# EAGLE schematic Maya Ayoub Custom Sch v40 (EAGLE 9.7.0)
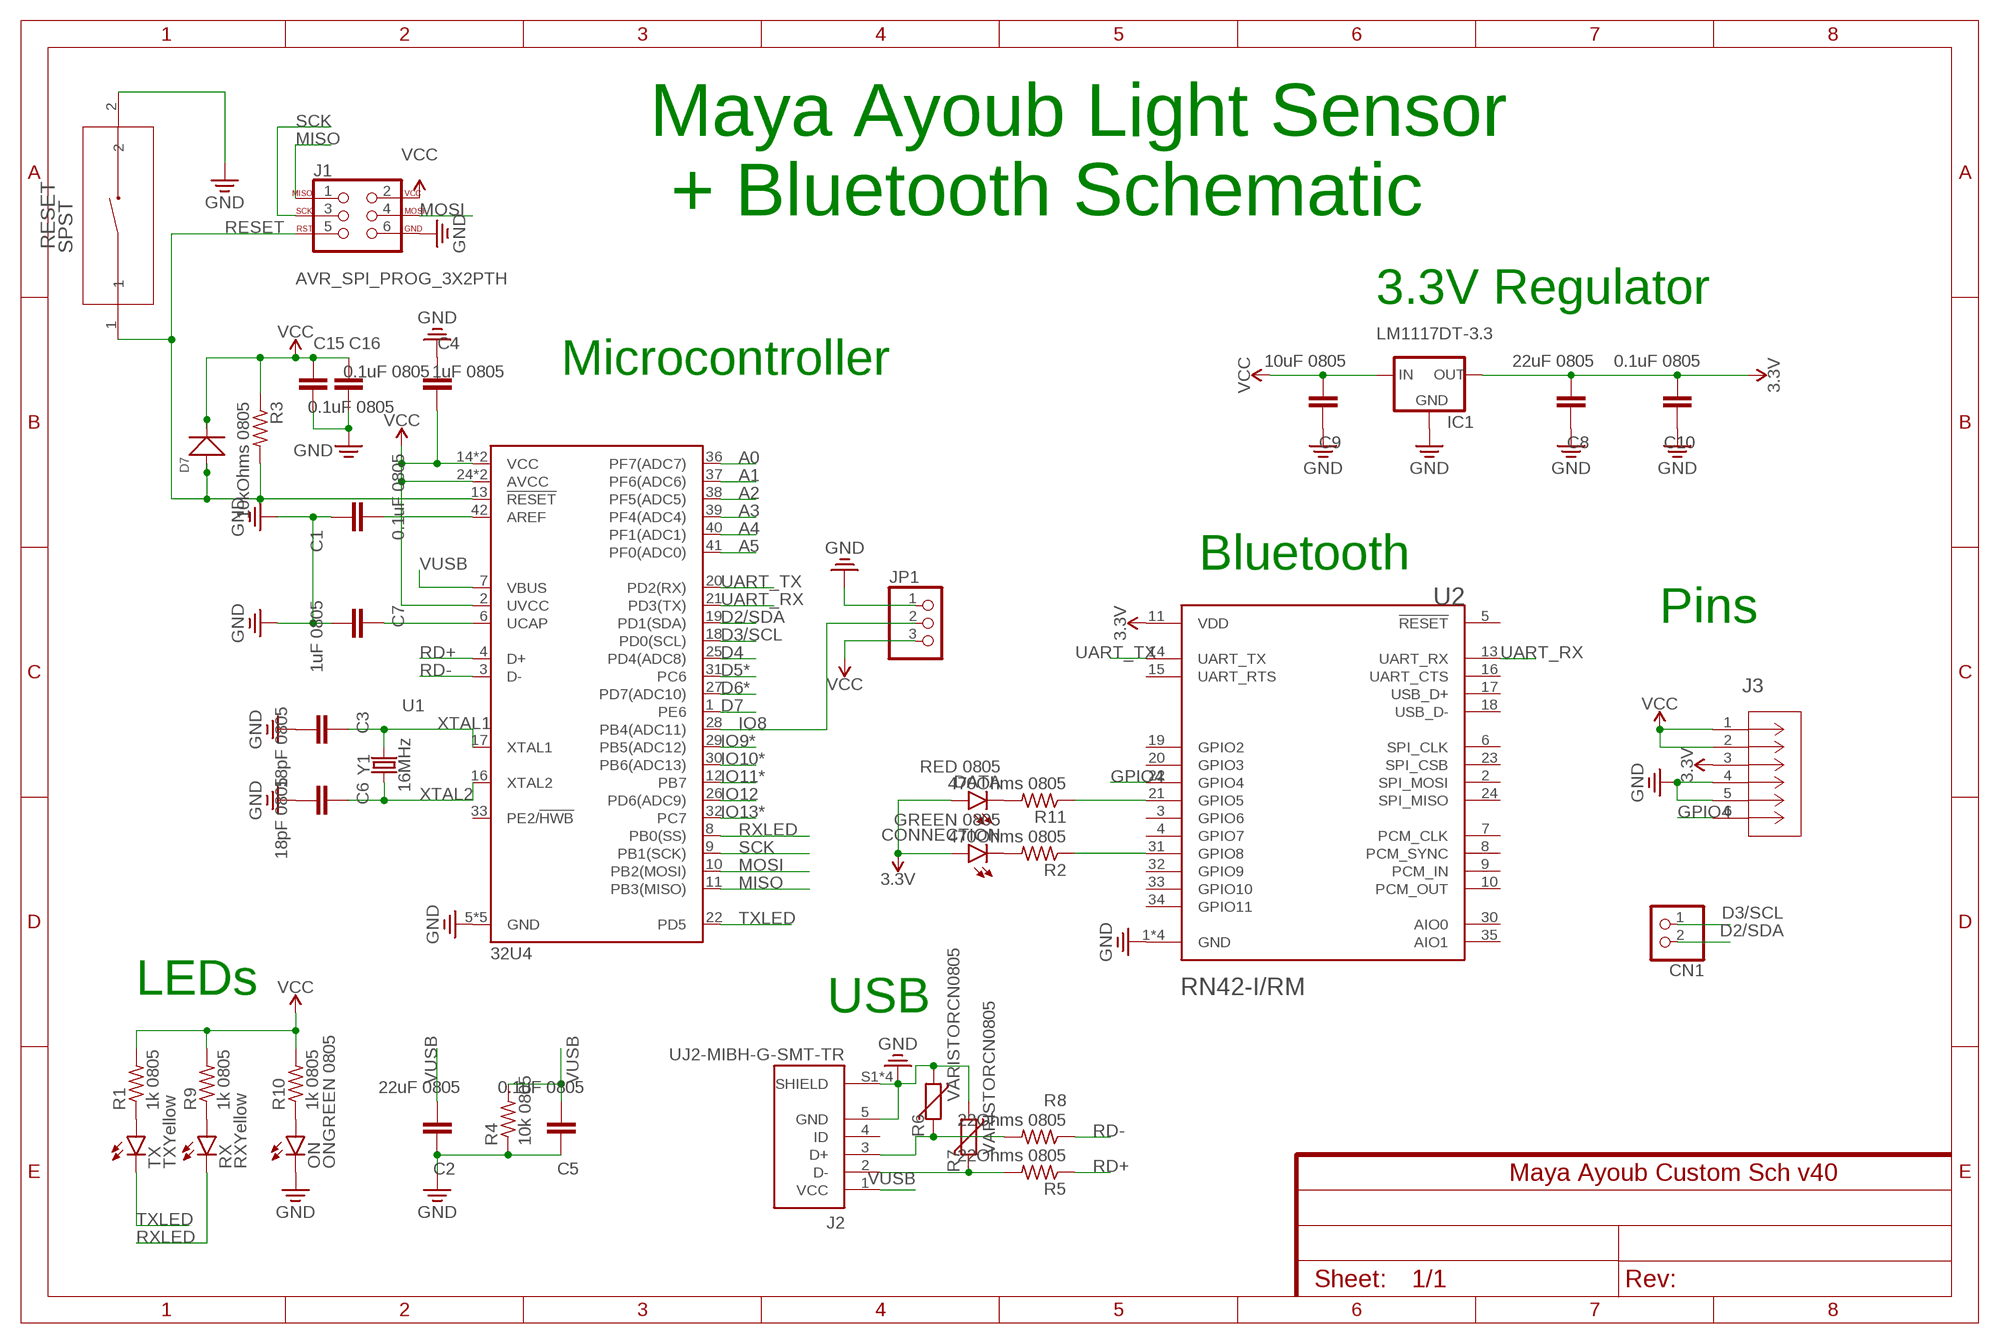
[diagram p0: schematic, sheet 1]

## Parts
C1  0.1uF 0805  CC0805KRX7R9BB104  [CAP_0805]
C2  22uF 0805  CC0805KRX7R9BB104  [CAP_0805]
C3  18pF 0805  CC0805KRX7R9BB104  [CAP_0805]
C4  1uF 0805  CC0805KRX7R9BB104  [CAP_0805]
C5  0.1uF 0805  CC0805KRX7R9BB104  [CAP_0805]
C6  18pF 0805  CC0805KRX7R9BB104  [CAP_0805]
C7  1uF 0805  CC0805KRX7R9BB104  [CAP_0805]
C8  22uF 0805  CC0805KRX7R9BB104  [CAP_0805]
C9  10uF 0805  CC0805KRX7R9BB104  [CAP_0805]
C10  0.1uF 0805  CC0805KRX7R9BB104  [CAP_0805]
C15  0.1uF 0805  CC0805KRX7R9BB104  [CAP_0805]
C16  0.1uF 0805  CC0805KRX7R9BB104  [CAP_0805]
CN1  JST_2PIN-SMT  [JST-PH-2-SMT]
CONNECTION  GREEN 0805  LEDCHIP-LED0805  [CHIP-LED0805]
D7  SMD-DIODE-SWITCHING-75V-150MA(D1206)  [LED-1206]
DATA  RED 0805  LEDCHIP-LED0805  [CHIP-LED0805]
IC1  LM1117DT-3.3  [TO252]
J1  AVR_SPI_PROG_3X2PTH  [2X3]
J2  UJ2-MIBH-G-SMT-TR  [CUI_UJ2-MIBH-G-SMT-TR]
J3  PPTC061LFBN-RCCONN6_061LFBN-RC_SUL  [CONN6_061LFBN-RC_SUL]
JP1  PINHD-1X3  [1X03]
ON  ONGREEN 0805  LEDCHIP-LED0805  [CHIP-LED0805]
R1  1k 0805  R-US_R0805  [R0805]
R2  470Ohms 0805  R-US_R0805  [R0805]
R3  10kOhms 0805  R-US_R0805  [R0805]
R4  10k 0805  R-US_R0805  [R0805]
R5  22Ohms 0805  R-US_R0805  [R0805]
R6  VARISTORCN0805  [CT/CN0805]
R7  VARISTORCN0805  [CT/CN0805]
R8  22Ohms 0805  R-US_R0805  [R0805]
R9  1k 0805  R-US_R0805  [R0805]
R10  1k 0805  R-US_R0805  [R0805]
R11  470Ohms 0805  R-US_R0805  [R0805]
RESET  SPST  PTS636_SK25J_SMTR_LFSSW_PTS636_SK25J_SMTR_LFS_CNK  [SW_PTS636_SK25J_SMTR_LFS_CNK]
RX  RXYellow  LEDCHIP-LED0805  [CHIP-LED0805]
TX  TXYellow  LEDCHIP-LED0805  [CHIP-LED0805]
U1  32U4  ATMEGA32U4TQFP-44  [TQFP44]
U2  RN42-I/RM  [XCVR_RN42-I/RM]
Y1  16MHz  CRYSTAL-16MHZSMD-5X3.2  [CRYSTAL-SMD-5X3.2-4PAD]

## Nets
A0: U1.36(PF7(ADC7))
A1: U1.37(PF6(ADC6))
A2: U1.38(PF5(ADC5))
A3: U1.39(PF4(ADC4))
A4: U1.40(PF1(ADC1))
A5: U1.41(PF0(ADC0))
D2/SDA: CN1.2 U1.19(PD1(SDA))
D3/SCL: CN1.1 U1.18(PD0(SCL))
D4: U1.25(PD4(ADC8))
D5*: U1.31(PC6)
D6*: U1.27(PD7(ADC10))
D7: U1.1(PE6)
GND: C1.1 C2.1 C3.2 C4.1 C5.1 C6.2 C7.2 C8.1 C9.1 C10.1 C15.2 C16.2 IC1.1(GND) J1.6 J2.5(GND) J2.S1(SHIELD) J2.S2(SHIELD) J2.S3(SHIELD) J2.S4(SHIELD) J3.4 J3.5 JP1.1 ON.C R4.1 R6.1 R7.1 RESET.2 U1.5(GND) U1.15(GND) U1.23(GND) U1.35(GND) U1.43(GND) U2.1(GND) U2.12(GND) U2.28(GND) U2.29(GND) U2.35(AIO1)
GPIO4: J3.6 U2.22(GPIO4)
IO8: JP1.2 U1.28(PB4(ADC11))
IO9*: U1.29(PB5(ADC12))
IO10*: U1.30(PB6(ADC13))
IO11*: U1.12(PB7)
IO12: U1.26(PD6(ADC9))
IO13*: U1.32(PC7)
MISO: J1.1 U1.11(PB3(MISO))
MOSI: J1.4 U1.10(PB2(MOSI))
N$1: J2.2(D-) R5.2 R7.2
N$2: J2.3(D+) R6.2 R8.2
N$3: R2.1 U2.31(GPIO8)
N$4: R11.1 U2.21(GPIO5)
N$5: C1.2 U1.42(AREF)
N$6: C7.1 U1.6(UCAP)
N$7: DATA.C R11.2
N$8: CONNECTION.C R2.2
N$10: R1.1 TX.A
N$11: ON.A R10.1
N$12: R9.1 RX.A
RD+: R5.1 U1.4(D+)
RD-: R8.1 U1.3(D-)
RESET: D7.+ J1.5 R3.2 RESET.1 U1.13(!RESET)
RXLED: RX.C U1.8(PB0(SS))
SCK: J1.3 U1.9(PB1(SCK))
TXLED: TX.C U1.22(PD5)
UART_RX: U1.21(PD3(TX)) U2.13(UART_RX)
UART_TX: U1.20(PD2(RX)) U2.14(UART_TX)
VCC: C4.2 C9.2 C15.1 C16.1 D7.- IC1.2(IN) J1.2 J3.1 J3.2 JP1.3 R1.2 R3.1 R9.2 R10.2 U1.2(UVCC) U1.14(VCC) U1.24(AVCC) U1.34(VCC) U1.44(AVCC)
VCC_2: C8.2 C10.2 CONNECTION.A DATA.A IC1.3(OUT) J3.3 U2.11(VDD) ; supply symbol labelled 3.3V
VUSB: C2.2 C5.2 J2.1(VCC) R4.2 U1.7(VBUS)
XTAL1: C3.1 U1.17(XTAL1) Y1.3
XTAL2: C6.1 U1.16(XTAL2) Y1.1
Unconnected: J2.4(ID) U1.33(PE2/!HWB) U2.2(SPI_MOSI) U2.3(GPIO6) U2.4(GPIO7) U2.5(!RESET) U2.6(SPI_CLK) U2.7(PCM_CLK) U2.8(PCM_SYNC) U2.9(PCM_IN) U2.10(PCM_OUT) U2.15(UART_RTS) U2.16(UART_CTS) U2.17(USB_D+) U2.18(USB_D-) U2.19(GPIO2) U2.20(GPIO3) U2.23(SPI_CSB) U2.24(SPI_MISO) U2.30(AIO0) U2.32(GPIO9) U2.33(GPIO10) U2.34(GPIO11)

## Notes on the sheet
- Maya Ayoub Light Sensor
   + Bluetooth Schematic
- 3.3V Regulator
- Microcontroller
- Bluetooth
- Pins
- LEDs
- USB

## Library data of the parts
C1-C10 C15 C16 = Resistor_Capacitor:CC0805KRX7R9BB104: CAP CER 0.1UF 50V X7R 0805 Manufacturer's datasheet <http://www.yageo.com/documents/recent/UPY-GPHC_X7R_6.3V-to-50V_18.pdf>; CREATED_BY: PCBLayout.com; DIGIKEY_PART_NUMBER: 311-1140-2-ND; MANUFACTURER: Yageo; MPN: CC0805KRX7R9BB104; PACKAGE: SMD 0805
CN1 = adafruit:JST_2PIN: JST 2-Pin Connectors of various flavors SMT-RA (S2B-PH-SM4) 4UConnector #17311 SMT (B2B-PH-SM4) THM-RA (S2B-PH) THM (B2B-PH)
CONNECTION DATA ON RX TX = led:LED: LED OSRAM: - CHIPLED LG R971, LG N971, LY N971, LG Q971, LY Q971, LO R971, LY R971 LH N974, LH R974 LS Q976, LO Q976, LY Q976 LO Q996 - Hyper CHIPLED LW Q18S LB Q993, LB Q99A, LB R99A - SideLED LS A670, LO A670, LY A670, LG A670, LP A670 LB A673, LV A673, LT A673, LW A673 LH A674 LY A675 LS A676, LA A676, LO A676, LY A676, LW A676 LS A679, LY A679, LG A679 - Hyper Micro SIDELED® LS Y876, LA Y876, LO Y876, LY Y876 LT Y87S - SmartLED LW L88C, LW L88S LB L89C, LB L89S, LG L890 LS L89K, LO L89K, LY L89K LS L896, LA L896, LO L896, LY L896 - TOPLED LS T670, LO T670, LY T670, LG T670, LP T670 LSG T670, LSP T670, LSY T670, LOP T670, LYG T670 LG T671, LOG T671, LSG T671 LB T673, LV T673, LT T673, LW T673 LH T674 LS T676, LA T676, LO T676, LY T676, LB T676, LH T676, LSB T676, LW T676 LB T67C, LV T67C, LT T67C, LS T67K, LO T67K, LY T67K, LW E67C LS E67B, LA E67B, LO E67B, LY E67B, LB E67C, LV E67C, LT E67C LW T67C LS T679, LY T679, LG T679 LS T770, LO T770, LY T770, LG T770, LP T770 LB T773, LV T773, LT T773, LW T773 LH T774 LS E675, LA E675, LY E675, LS T675 LS T776, LA T776, LO T776, LY T776, LB T776 LHGB T686 LT T68C, LB T68C - Hyper Mini TOPLED® LB M676 - Mini TOPLED Santana® LG M470 LS M47K, LO M47K, LY M47K Source: http://www.osram.convergy.de LUXEON: - LUMILED® LXK2-PW12-R00, LXK2-PW12-S00, LXK2-PW14-U00, LXK2-PW14-V00 LXK2-PM12-R00, LXK2-PM12-S00, LXK2-PM14-U00 LXK2-PE12-Q00, LXK2-PE12-R00, LXK2-PE12-S00, LXK2-PE14-T00, LXK2-PE14-U00 LXK2-PB12-K00, LXK2-PB12-L00, LXK2-PB12-M00, LXK2-PB14-N00, LXK2-PB14-P00, LXK2-PB14-Q00 LXK2-PR12-L00, LXK2-PR12-M00, LXK2-PR14-Q00, LXK2-PR14-R00 LXK2-PD12-Q00, LXK2-PD12-R00, LXK2-PD12-S00 LXK2-PH12-R00, LXK2-PH12-S00 LXK2-PL12-P00, LXK2-PL12-Q00, LXK2-PL12-R00 Source: www.luxeon.com KINGBRIGHT: KA-3528ASYC Source: www.kingbright.com
D7 = SMD-DIODE-SWITCHING-75V-150MA_D1206_:SMD-DIODE-SWITCHING-75V-150MA(D1206): 304040005 Check prices <https://pricing.snapeda.com/parts/CD1206-S01575/Bourns/view-part?ref=eda>; AVAILABILITY: Warning; DESCRIPTION: Diode Standard 100V 150mA Surface Mount 1206; MF: Bourns; MP: CD1206-S01575; PACKAGE: 1206 Bourns; PRICE: None
IC1 = lm1117_10:LM1117?-*: 800mA Low-Dropout Linear Regulator Source: http://www.ti.com/lit/ds/symlink/lm1117-n.pdf; MF: Texas Instruments; MPN: LM1117DT-3.3; OC_FARNELL: 1469048; OC_NEWARK: 41K3430
J1 = SparkFun-Connectors:AVR_SPI_PROG_3X2: AVR ISP 6 Pin This is the reduced ISP connector for AVR programming. Common on Arduino. This footprint will take up less PCB space and can be used with a 10-pin to 6-pin adapter such as SKU: BOB-08508 **Special note about "TEST_POINT" package. The stop mask is on the top side, so if you want your programming test points to be on the bottom of your board, make sure to place this package on the bottom side of the board. This also ensure that the orientation to program from the bottom side will be correct. SparkFun Products: SparkFun ISP Pogo Adapter <https://www.sparkfun.com/products/11591> - NS Tiny AVR Programmer <https://www.sparkfun.com/products/11801> -PTH
J2 = UJ2-MIBH-G-SMT-TR:UJ2-MIBH-G-SMT-TR: USB micro B type receptacle; CUI_PURCHASE_URL: https://www.cuidevices.com/product/interconnect/connectors/usb-connectors/uj2-mibh-g-smt-tr?utm_source=snapeda.com&utm_medium=referral&utm_campaign=snapedaBOM; DESCRIPTION: Micro B, USB 2.0, 1.8 A, Right Angle, Surface Mount (SMT), USB Receptacle; DIGI-KEY_PART_NUMBER: 2223-UJ2-MIBH-G-SMT-TRCT-ND; MF: CUI Devices; MP: UJ2-MIBH-G-SMT-TR; PACKAGE: None; PURCHASE-URL: https://pricing.snapeda.com/search/part/UJ2-MIBH-G-SMT-TR/?ref=eda
J3 = 2021-10-12_06-33-55_Library:PPTC061LFBN-RC; COPYRIGHT: Copyright (C) 2021 Ultra Librarian. All rights reserved.; DIGI-KEY_PART_NUMBER_1: S7004-ND; MANUFACTURER_PART_NUMBER: PPTC061LFBN-RC; MFR_NAME: Sullins
JP1 = adafruit:PINHD-1X3: PIN HEADER
R1-R5 R8-R11 = rcl:R-US_: RESISTOR, American symbol; SPICEPREFIX: R
R6 R7 = varistor:VARISTOR: VARISTOR
RESET = 2021-10-08_06-17-12_Library:PTS636_SK25J_SMTR_LFS; COPYRIGHT: Copyright (C) 2021 Ultra Librarian. All rights reserved.; DIGI-KEY_PART_NUMBER_1: CKN12326-2-ND; DIGI-KEY_PART_NUMBER_2: CKN12326-1-ND; DIGI-KEY_PART_NUMBER_3: CKN12326-6-ND; MANUFACTURER_PART_NUMBER: PTS636 SK25J SMTR LFS; MFR_NAME: C&K
U1 = SparkFun-IC-Microcontroller:ATMEGA32U4: Atmel MCU, 32KByte Atmel 44-pin 8-bit Microcontroller with 32KBytes of ISP Flash and USB Controller Datasheet <http://cdn.sparkfun.com/datasheets/Dev/Arduino/Boards/ATMega32U4.pdf> SparkFun Products LilyPad Arduino USB - ATmega32U4 Board <https://www.sparkfun.com/products/12049> (DEV-12049) Pro Micro - 5V/16MHz <https://www.sparkfun.com/products/12640> (DEV-12640) Pro Micro - 3.3V/8MHz <https://www.sparkfun.com/products/12587> (DEV-12587) Fio v3 - ATmega32U4 <https://www.sparkfun.com/products/11520> (DEV-11520) Qduino Mini <https://www.sparkfun.com/products/13614> (DEV-13614) Makey Makey - Standard Kit <https://www.sparkfun.com/products/11511> (WIG-11511) Makey Makey Deluxe Kit <https://www.sparkfun.com/products/11519> (WIG-11519); PROD_ID: IC-11161; SPICEPREFIX: X
U2 = RN42-I_RM:RN42-I/RM: Bluetooth 2.1 class 2 surface mount module with built in antenna Check prices <https://pricing.snapeda.com/parts/RN42-I/RM/Microchip/view-part?ref=eda>; AVAILABILITY: In Stock; DESCRIPTION: Bluetooth Bluetooth v2.1 +EDR Transceiver Module 2.4GHz Integrated, Trace Surface Mount; MF: Microchip; MP: RN42-I/RM; PACKAGE: None; PRICE: None; PURCHASE-URL: https://pricing.snapeda.com/search/part/RN42-I/RM/?ref=eda
Y1 = SparkFun-Clocks:CRYSTAL-16MHZ: 16MHz Crystal Digikey Example <http://www.digikey.com/product-search/en?keywords=535-9122-1-ND> Frequency: 16MHz Frequency Stability: ±50ppm Frequency Tolerance: ±20ppm Load Capacitance: 18pF SparkFun Products: Pro Micro -5V/16MHz <https://www.sparkfun.com/products/12640> SparkFun Serial Enabled LCD Kit <https://www.sparkfun.com/products/10097>; PROD_ID: XTAL-08218; SF_ID: COM-00094

## Module FUSE-0.5A-5V
Ports: 

### Library data of the parts

## Module FERRITEBEAD-30O@100MHZ
Ports: 

### Library data of the parts